# EAGLE design esp_0.3 (EAGLE 6.4)
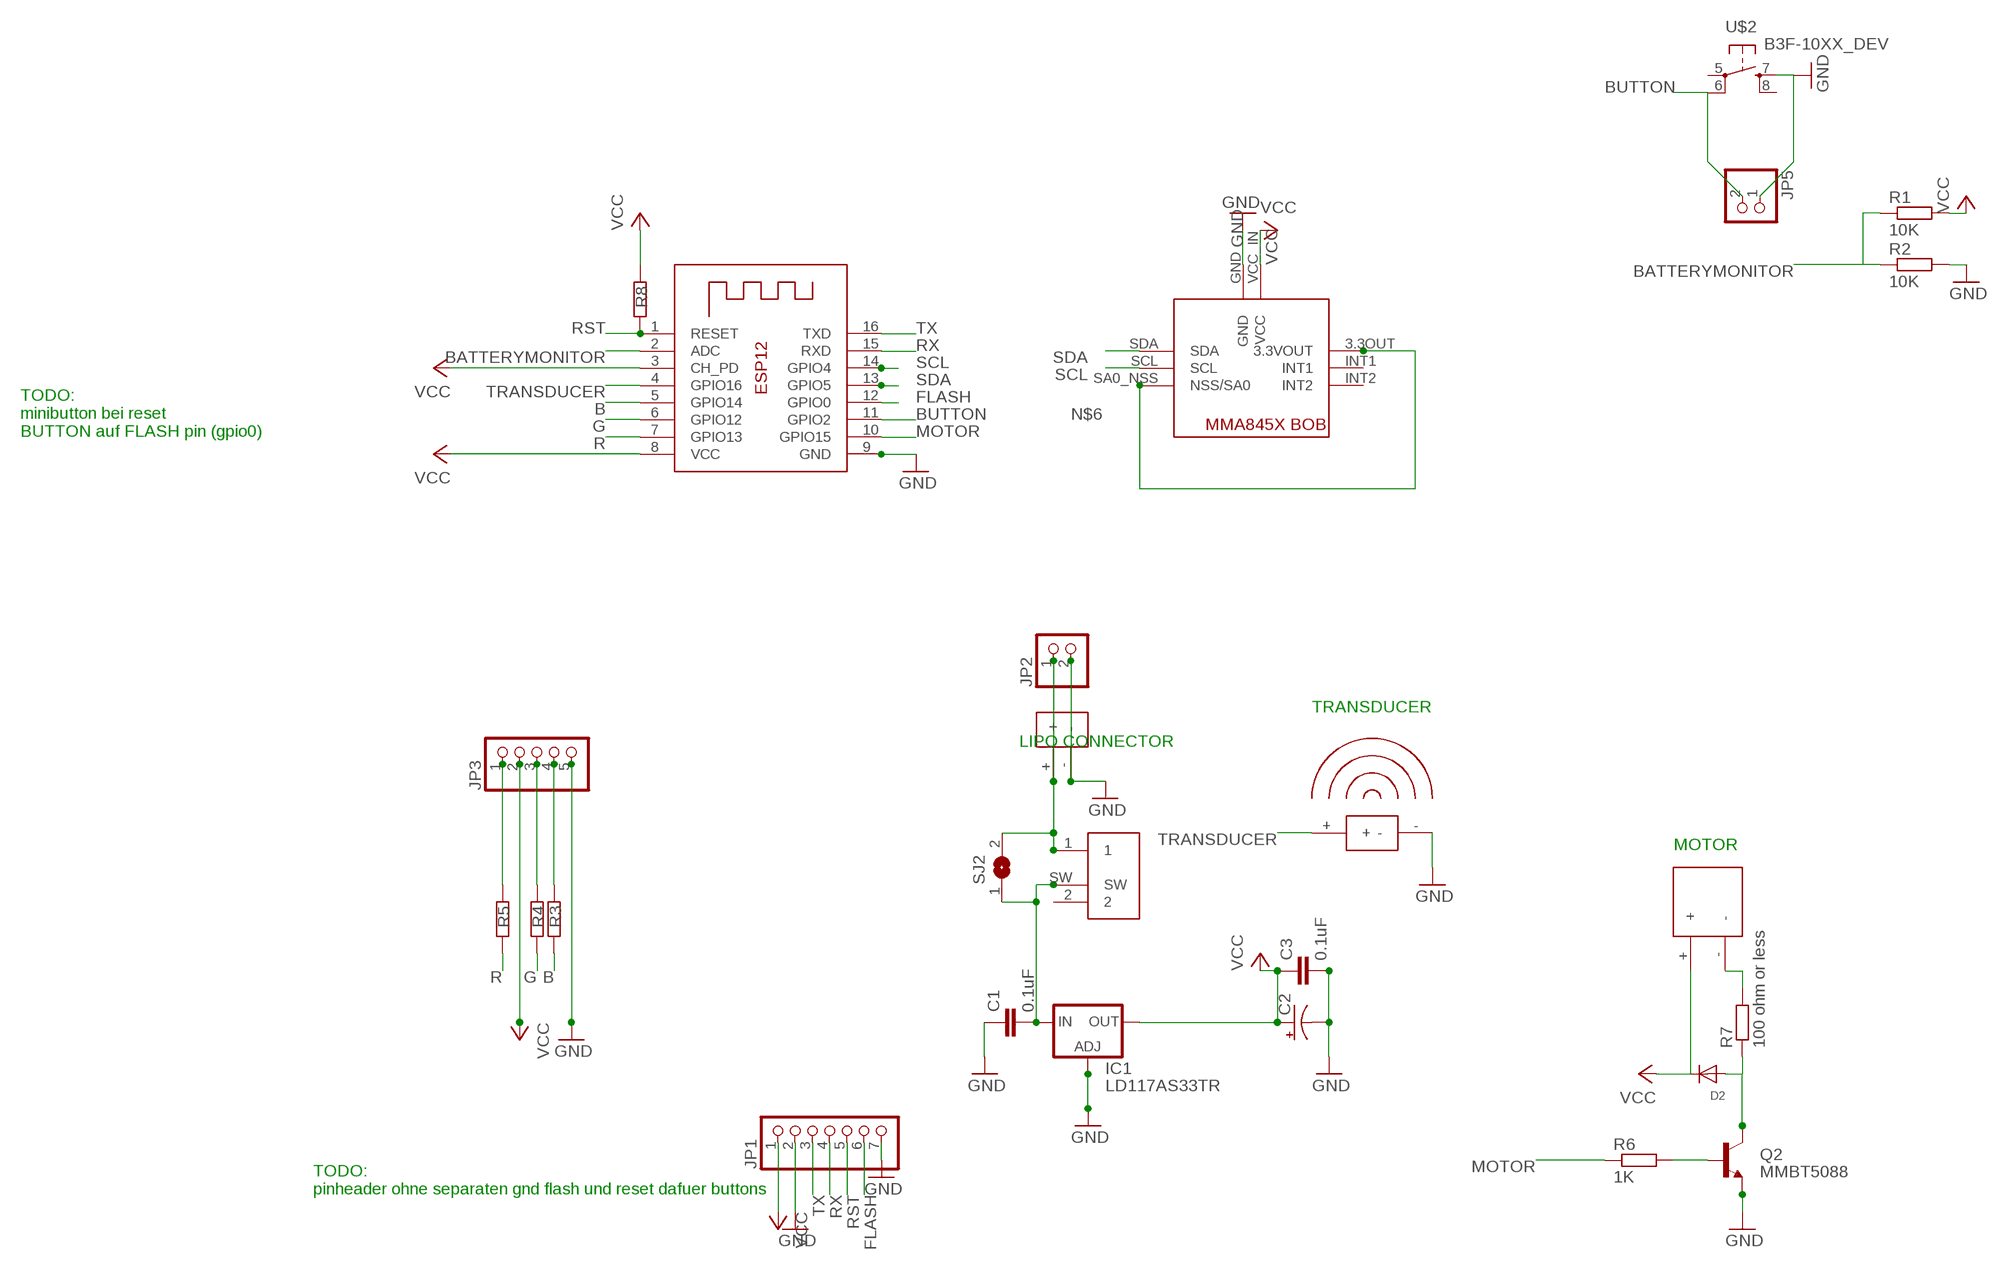
[diagram p0: schematic, sheet 1]

## Parts
C1  0.1uF  CAP0805  [0805]
C2  100UF-25V-20%(PTH)  [CPOL-RADIAL-100UF-25V]
C3  0.1uF  CAP0805  [0805]
D2  DIODE_SOD-123FL  [SOD-123FL]
IC1  LD117AS33TR  [SOT223]
JP1  PINHD-1X7  [1X07]
JP2  PINHD-1X2  [1X02]
JP3  PINHD-1X5  [1X05]
JP5  PINHD-1X2/90  [1X02/90]
Q2  MMBT5088  TRANSISTOR_NPNMMBT5088  [SOT23-3]
R1  10K  R-EU_R0805  [R0805]
R2  10K  R-EU_R0805  [R0805]
R3  1K  R-EU_R0805  [R0805]
R4  1K  R-EU_R0805  [R0805]
R5  1K  R-EU_R0805  [R0805]
R6  1K  R-EU_R0805  [R0805]
R7  100 ohm or less  R-EU_R0805  [R0805]
R8  56K pullup  R-EU_R0805  [R0805]
SJ2  SJ  [SJ]
U$1  MMA845X_BREAKOUT  [MMA845XBOB]
U$2  B3F-10XX_DEV  [B3F-10XX]
U$8  TRANSDUCER  [BMT1205XH7.5]
U$11  MICROSWITCH  [MICR_SCHIEBESCHALTER_CHINA_PAC]
U$12  VIBROMOTOR  [VIBRO]
U$13  LIPO  [LIPOCON]
X2  ESP-12  [ESP-12]

## Nets
B: R3.1 X2.5(GPIO14)
BATTERYMONITOR: R1.1 R2.1 X2.2(ADC)
BUTTON: JP5.2 U$2.6(P1) X2.11(GPIO2)
FLASH: JP1.6 X2.12(GPIO0)
G: R4.1 X2.6(GPIO12)
GND: C1.1 C2.2(-) C3.2 IC1.1(ADJ) JP1.2 JP1.7 JP2.2 JP3.5 JP5.1 Q2.2(E) R2.2 U$1.GND U$2.7(S) U$8.- U$13.- X2.9(GND)
MOTOR: R6.1 X2.10(GPIO15)
N$1: R7.2 U$12.-
N$2: JP2.1 SJ2.2 U$11.1 U$13.+
N$3: D2.A Q2.3(C) R7.1
N$4: Q2.1(B) R6.2
N$5: C1.2 IC1.3(IN) SJ2.1 U$11.SW
N$6: U$1.3.3OUT(3.3VOUT) U$1.SA0_NSS(NSS/SA0)
R: R5.1 X2.7(GPIO13)
RST: JP1.5 R8.1 X2.1(RESET)
RX: JP1.4 X2.15(RXD)
SCL: U$1.SCL X2.14(GPIO4)
SDA: U$1.SDA X2.13(GPIO5)
TRANSDUCER: U$8.+ X2.4(GPIO16)
TX: JP1.3 X2.16(TXD)
VCC: C2.1(+) C3.1 D2.C IC1.4(OUT) JP1.1 JP3.2 R1.2 R8.2 U$1.VCC_IN(VCC) U$12.+ X2.3(CH_PD) X2.8(VCC)
XX: JP3.1 R5.2
XXX: JP3.3 R4.2
XXXX: JP3.4 R3.2
Unconnected: U$1.INT1 U$1.INT2 U$2.5(P) U$2.8(S1) U$11.2

## Notes on the sheet
- TODO:
  minibutton bei reset
  BUTTON auf FLASH pin (gpio0)
- TRANSDUCER
- LIPO CONNECTOR
- MOTOR
- TODO:
  pinheader ohne separaten gnd flash und reset dafuer buttons

## Library data of the parts
C1 C3 = SparkFun-Passives:CAP: Capacitor Standard 0603 ceramic capacitor, and 0.1" leaded capacitor.
C2 = SparkFun-Capacitors:100UF-25V-20%(PTH): CAP-08439; PROD_ID: CAP-08439
D2 = adafruit:DIODE: Diode SMADIODE - SMA Surface Mount Package 20V 1A Schottky Diode Digikey: 641-1014-6-ND DO-1N4148 - Through Hole Small Current Diode SOD-123 20V 1 A (.5mV Vf) Schottky Diode - Digikey: MBRX120TPMSCT-ND SOD-323 10V 570mA (.38mV Vf, 3ns) Schottky Diode - Digikey: ZLLS410CT-ND SOD-523 30V 30mA Schottky Diode (RB751S-40TE61) - Digikey: RB751S-40TE61CT-ND SOT23-R/W - SOT23 Package (R = Solder Paste/Reflow Ovens, W = Hand-Soldering) BAT54Film 40V 300mA - Digikey: 497-7162-1-ND
IC1 = v-reg:LD117A?*: Low drop fixed and adjustable positive voltage regulators 1 A Source: http://www.st.com/stonline/products/literature/ds/7194/ld1117axx.pdf
JP1 = pinhead:PINHD-1X7: PIN HEADER
JP2 JP5 = pinhead:PINHD-1X2: PIN HEADER
JP3 = pinhead:PINHD-1X5: PIN HEADER
Q2 = SparkFun-DiscreteSemi:TRANSISTOR_NPN: Generic NPN BJT MMBT2222A - TRANS-08049 (SOT-23, 1A 40V) MPSA42 - TRANS-09116 (SOT-23, 500mA 300V) MMBT5088LT1G - TRANS-11160 (SOT-23, 50 mA 30V) BC547 - COM-08928 <http://www.sparkfun.com/products/8928> (TO-92 45V 100mA) (1.Collector 2.Base 3.Emitter) 2N3904 - COM-00521 <http://www.sparkfun.com/products/521> (TO-92 40V 200mA) (1.Emitter 2.Base 3.Collector) P2N2222A - COM-12852 <http://www.sparkfun.com/products/12852> (TO-92 40V 600mA) (1.Collector 2.Base 3.Emitter); PROD_ID: TRANS-11160
R1-R8 = resistor:R-EU_: RESISTOR, European symbol
SJ2 = jumper:SJ: SMD solder JUMPER
U$1 = roust:MMA845X_BREAKOUT
U$2 = timemachine:B3F-10XX_DEV
U$8 = ghoust:TRANSDUCER
U$11 = roust:MICROSWITCH
U$12 = ghoust:VIBROMOTOR
U$13 = roust:LIPO
X2 = adafruit:ESP-12

## Board
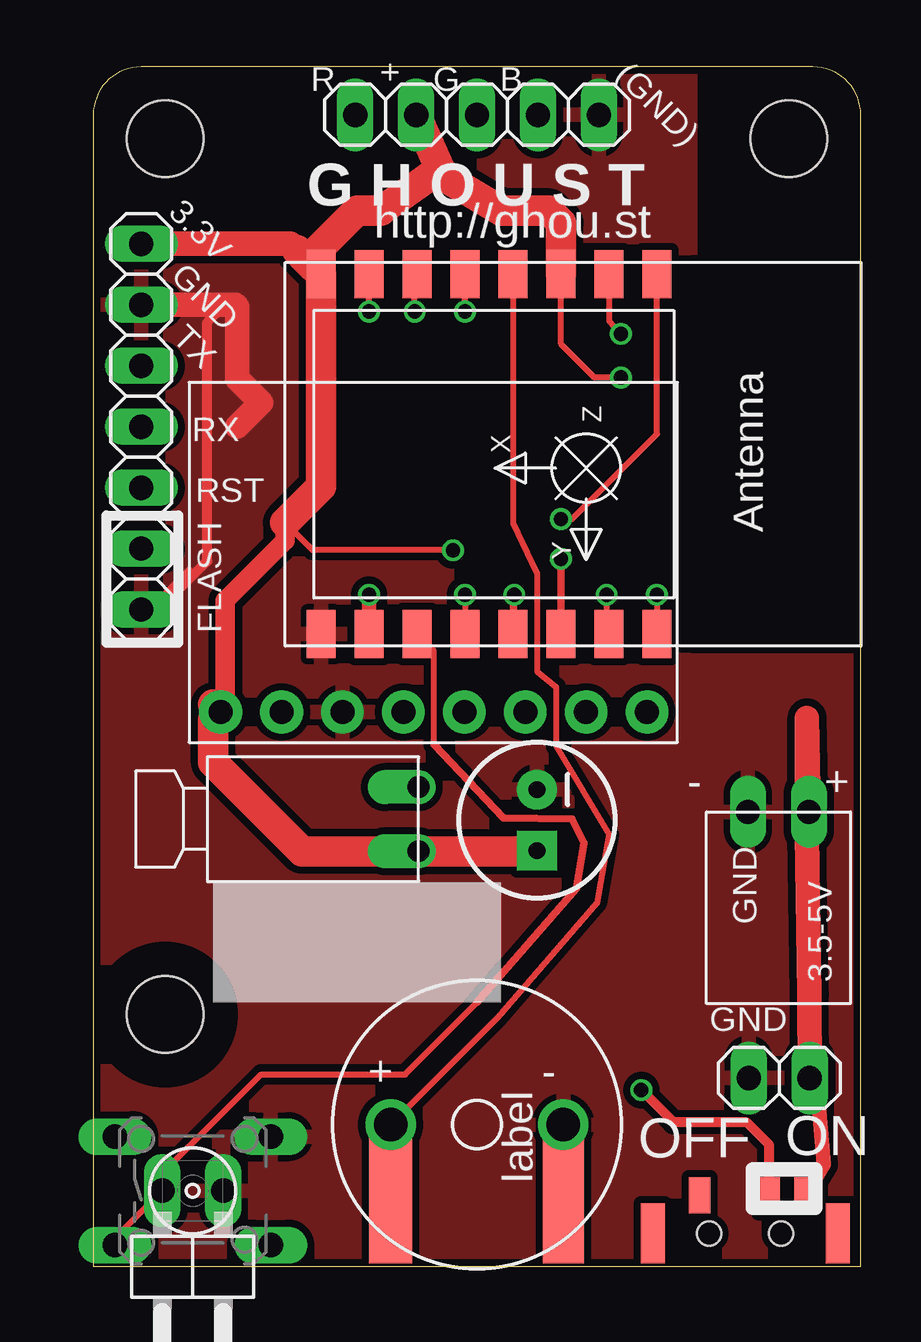
[diagram p1: board, top side]
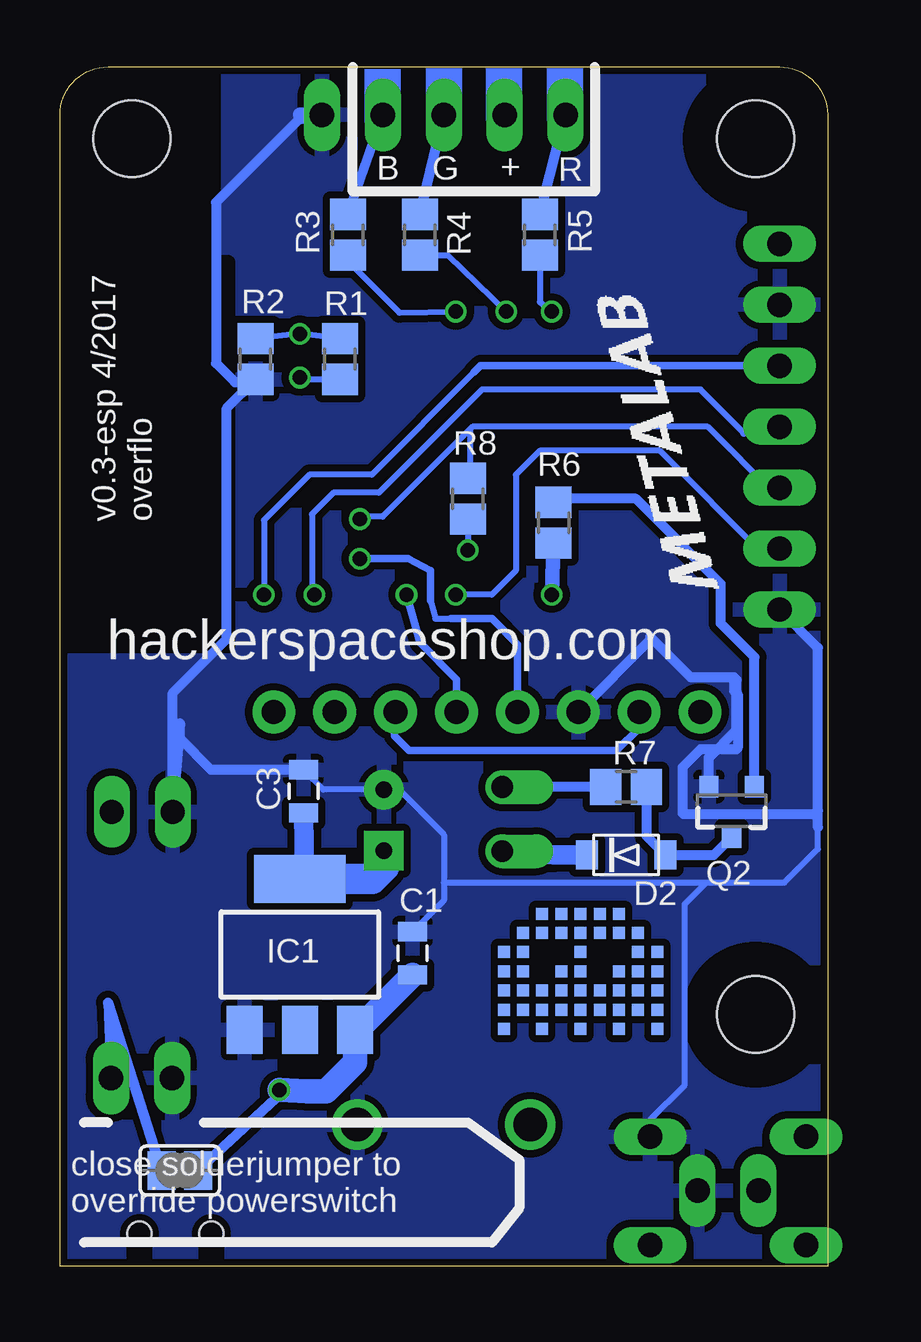
[diagram p2: board, bottom side, seen from below]

Size 32 x 50 mm. Coordinates in mm from the lower left corner, seen from the top.
Outline: 0,0 32,0 32,48 arc90 30,50 2,50 arc90 0,48 0,0
Copper layers (1*16): Top 0.035mm / dielectric 1.5mm / Bottom 0.035mm
Design rules "Fusion_eagle_rule_v1.1": minimum track width 6mil, minimum drill 12mil, track to track 6mil, track to pad 6mil, pad to pad 6mil, via to via 6mil, smd to smd 0mil, copper to edge 10mil, drill to drill 10mil, minimum pad ring 10mil, minimum via ring 6mil, stop-mask expansion 2mil, vias tented up to drill 100mil, thermal gap 10mil
Holes 3.2 mm at 3,10.5 29,47 3,47
tRestrict: area 0.4,7.9 to 5.6,13.1; area 26.4,44.4 to 31.6,49.6; area 0.4,44.4 to 5.6,49.6; area 25.5,26 to 34,50.7
bRestrict: area 0.4,7.9 to 5.6,13.1; area 26.4,44.4 to 31.6,49.6; area 0.4,44.4 to 5.6,49.6; area 25.6,26 to 34,50.7

### Footprints (pad centres in the part's own frame; a part is rotated, then mirrored left to right if it is on the bottom)
0805 = smd 0.8 x 1.2: 1 -0.9,0; 2 0.9,0
CPOL-RADIAL-100UF-25V = drill 0.7 pad 1.651 square: 1 1.27,0 | drill 0.7 pad 1.651: 2 -1.27,0
SOD-123FL = smd 0.91 x 1.22: A 1.637,0; C -1.637,0
SOT223 = smd 1.5 x 2: 1 -2.3,-3.15; 2 0,-3.15; 3 2.3,-3.15 | smd 3.8 x 2: 4 0,3.15
1X07 = drill 1.016 long: 1 -7.62,0; 2 -5.08,0; 3 -2.54,0; 4 0,0; 5 2.54,0; 6 5.08,0; 7 7.62,0
1X02 = drill 1.016 long: 1 -1.27,0; 2 1.27,0
1X05 = drill 1.016 long: 1 -5.08,0; 2 -2.54,0; 3 0,0; 4 2.54,0; 5 5.08,0
1X02/90 = drill 1.016 long: 1 -1.27,-3.81; 2 1.27,-3.81
SOT23-3 = smd 0.8 x 0.9: 1 -0.95,-1; 2 0.95,-1; 3 0,1.1
R0805 = smd 1.3 x 1.5: 1 -0.85,0; 2 0.85,0
SJ = smd 1.168 x 1.6: 1 -0.762,0; 2 0.762,0
MMA845XBOB = drill 1 pad 1.778: 3.3OUT 1.27,16.51; GND 1.27,13.97; INT1 1.27,1.27; INT2 1.27,3.81; SA0_NSS 1.27,6.35; SCL 1.27,11.43; SDA 1.27,8.89; VCC_IN 1.27,19.05
B3F-10XX = drill 1.016 long: 5 -3.251,2.261; 6 -3.251,-2.261; 7 3.251,2.261; 8 3.251,-2.261
GHOUST_LOGO = smd 0.5 x 0.5: P$1 0,0; P$2 -0.8,0; P$3 0.8,0; P$4 -1.6,0; P$5 1.6,0; P$6 -2.4,-0.8; P$7 -1.6,-0.8; P$8 -0.8,-0.8; P$9 0,-0.8; P$10 0.8,-0.8; P$11 1.6,-0.8; P$12 2.4,-0.8; P$13 -3.2,-1.6; P$14 -2.4,-1.6; P$15 3.2,-1.6; P$16 2.4,-1.6; P$17 0,-1.6; P$18 -3.2,-2.4; P$19 -2.4,-2.4; P$20 -0.8,-2.4; P$21 0,-2.4; P$22 1.6,-2.4; P$23 2.4,-2.4; P$24 3.2,-2.4; P$25 -3.2,-3.2; P$26 -2.4,-3.2; P$27 -0.8,-3.2; P$28 -1.6,-3.2; P$29 0,-3.2; P$30 0.8,-3.2; P$31 2.4,-3.2; P$32 1.6,-3.2; P$33 3.2,-3.2; P$34 -3.2,-4; P$35 -1.6,-4; P$36 0,-4; P$37 1.6,-4; P$38 2.4,-4; P$39 3.2,-4; P$40 0.8,-4; P$41 -0.8,-4; P$42 -2.4,-4; P$43 -3.2,-4.8; P$44 -1.6,-4.8; P$45 0,-4.8; P$46 1.6,-4.8; P$47 3.2,-4.8
BMT1205XH7.5 = drill 1.4: + -3.6,0; - 3.6,0 | smd 1.8 x 6: +_PAD -3.6,-2.77 | smd 1.7 x 6: _-PAD 3.6,-2.77
MICR_SCHIEBESCHALTER_CHINA_PAC = smd 0.9 x 1.5: 1 2.5,1.6; 2 -1.9,1.6; SW 1,1.6 | smd 1 x 2.5: GND1 -3.85,0; GND2 3.85,0 | hole 1: -1.5,0; 1.5,0
VIBRO = drill 0.9 pad 1.2 offset: + -1.34,0; - 1.34,0
LIPOCON = drill 1 long: + -1.27,0; - 1.27,0
ESP-12 = smd 2 x 1.2: 1 -7.5,4.5; 2 -7.5,2.5; 3 -7.5,0.5; 4 -7.5,-1.5; 5 -7.5,-3.5; 6 -7.5,-5.5; 7 -7.5,-7.5; 8 -7.5,-9.5; 9 7.5,-9.5; 10 7.5,-7.5; 11 7.5,-5.5; 12 7.5,-3.5; 13 7.5,-1.5; 14 7.5,0.5; 15 7.5,2.5; 16 7.5,4.5

### Placement (x,y rotation side)
C1  17.3,13.05 270 bottom
C2  18.5,18.6 270 top
C3  21.85,19.8 90 bottom
D2  8.4,17.15 0 bottom
IC1  22,13 0 bottom
JP1  2,35 270 top
JP2  28.6,7.85 180 top
JP3  16,48 0 top
JP5  4.15,-0.65 180 top
Q2  4,19 180 bottom
R1  20.32,37.82 270 bottom
R2  23.85,37.82 270 bottom
R3  20,43 90 bottom
R4  17,43 90 bottom
R5  12,43 90 bottom
R6  11.42,31 90 bottom
R7  8.4,19.99 180 bottom
R8  15,32 270 bottom
SJ2  27,4 180 bottom
U$1  24.36,21.84 90 top
U$2  4.15,3.15 0 top
U$4  [METALAB]  4.21,27.73 90 bottom
U$6  GHOUT_LOGO  [GHOUST_LOGO]  10.3,14.7 0 bottom
U$8  16,5.91 0 top
U$11  27.18,1.37 0 top
U$12  13.56,18.64 90 top
U$13  28.57,18.95 180 top
X2  19,33.85 270 top

### Tracks (layer width: path | path; a pad name or v marks a point on that pad's centre or on a via)
B  (via drill 0.6)
  Top 0.254: v15.5,39.8 X2.5
  Bottom 0.254: R3.1 20,41.9 17.85,39.75 v15.5,39.8
BATTERYMONITOR  (via drill 0.6)
  Top 0.254: X2.2 21.5,39.42 v22,38.87
  Bottom 0.254: R1.1 v22,38.87 R2.1
BUTTON
  Top 0.254: U$2.6 0.9,1.18 JP5.2 2.88,3.88 7,8 13,8 16,11 | 14.2,21.75 14.2,25.65 X2.11
  Top 0.305: 14.2,21.75 17.1,18.7 19.95,18.65 20.45,17.65 20.15,15.75 16,11
FLASH  (via drill 0.6)
  Top 0.254: v15.5,28 X2.12
  Bottom 0.254: 2.65,29.65 7,34 12,34 13,33 13,29 14,28 v15.5,28
  Bottom 0.305: JP1.6 2.38,29.92 2.65,29.65
G  (via drill 0.6)
  Top 0.254: v13.4,39.8 13.4,41.25 X2.6
  Bottom 0.254: R4.1 15.85,42.15 v13.4,39.8
GND
  Top 0.305: 2,27 4,29
  Top 0.406: 2,27 2.35,27 4.75,29.4 4.75,39.35 5.35,39.95 2.05,39.95 2,40
  Top 1.016: JP1.2 5.92,40.08 6,40 6,37 7,36 6,35
  Bottom 0.254: 16,16 16,15.25 C1.1 | 16,16 16,18 17.87,19.87 C2.2 21.02,19.87 C3.2 | 16,16 5.05,16 | 5.05,16 1.8,16 0.4,17.4 0.4,18.3 | U$2.7 7.4,6.1 5.95,7.55 5.95,15.1 5.05,16
  Bottom 0.406: Q2.2 4.95,21.2 3.8,22.35 3.8,24.45 3.9,24.55 | 3.9,24.55 5.7,24.55 7.4,26.25 7.4,26.1 U$1.GND | 0.4,18.3 0.4,19 | 0.4,19 0.4,25.78 JP1.7 | C3.2 25.7,20.7 27,22 27,22.65 U$13.- 27.3,23.9 25.05,26.15 25.05,35.77 R2.2 23.97,36.85 24.7,36.85 25.5,37.65 25.5,44.35 22.08,47.77 JP3.5 | 3.9,24.55 3.9,24 3.75,23.85 3.75,21.6 3.8,21.55 5.3,21.55 6.05,20.8 6.05,18.9 6,18.85 0.55,18.85 0.4,19
  Bottom 0.61: JP3.5 22,48
  pour Top (isolate 0.3): -1,51 34,51 34,-2 -1,-2
  pour Bottom (isolate 0.3): -1,51 34,51 34,-2 -1,-2
MOTOR  (via drill 0.6)
  Top 0.61: v11.5,28 X2.10
  Bottom 0.61: R6.1 v11.5,28
N$1
  Bottom 0.406: R7.2 U$12.-
N$2
  Top 0.61: U$11.1 30.45,4.25 29.86,11.34
  Top 1.016: 29.75,17.7 29.75,18 | 29.75,18 29.75,22.86 U$13.+ | JP2.1 29.86,11.34 29.75,18
  Bottom 0.406: SJ2.2 30,11 JP2.1
N$3
  Bottom 0.406: R7.1 7.55,17.94 D2.A 4.75,17.15 Q2.3
N$4
  Bottom 0.406: R6.2 11.27,32 8,32 4.45,28.45 4.45,26.8 3.05,25.4 Q2.1
N$5  (via drill 0.6)
  Top 0.406: U$11.SW 28.18,5.06 27.24,6 24.2,6 v22.85,7.35
  Bottom 0.406: SJ2.1 23,7 v22.85,7.35
  Bottom 1.016: v22.85,7.35 21.7,7.3 20.9,7.3 19.7,8.5 IC1.3 19.6,9.85 C1.2
N$6
  Bottom 0.305: U$1.3.3OUT 7.85,22.45 8.8,21.5 17.45,21.5 18.05,22.1 18.05,23.07 U$1.SA0_NSS
R  (via drill 0.6)
  Top 0.254: v11.5,39.8 X2.7
  Bottom 0.254: R5.1 12,40.2 v11.5,39.8
RST  (via drill 0.6)
  Top 0.254: v19.5,31.15 19.95,31.15 23.5,34.7 X2.1
  Bottom 0.254: 2.19,32.19 5,35 14.8,35 14.9,34.9 | 14.9,34.9 18.55,31.25 19.7,31.25 v19.5,31.15 | 14.9,34.9 14.9,32.95 R8.1
  Bottom 0.305: JP1.5 2,32.38 2.19,32.19
RX  (via drill 0.6)
  Top 0.254: v21.4,28 21.4,26.45 X2.15
  Bottom 0.254: 3.48,34.73 5.3,36.55 14.4,36.55 18.7,32.25 20.6,32.25 21.5,31.35 21.5,28.1 v21.4,28
  Bottom 0.305: JP1.4 3.21,35 3.48,34.73
SCL  (via drill 0.6)
  Top 0.305: v19.5,29.5 X2.14
  Bottom 0.254: 16.55,27.75 16.35,27 15.7,27
  Bottom 0.305: U$1.SCL 12.93,25.93 14,27 15.7,27 | v19.5,29.5 17.5,29.5 16.55,29 16.55,27.75
SDA  (via drill 0.6)
  Top 0.305: v17.55,28 X2.13
  Top 0.406: 17.47,26.47 X2.13
  Bottom 0.305: U$1.SDA 15.47,24.47 17,26 v17.55,28
TRANSDUCER
  Top 0.254: X2.4 17.5,31 18.5,28.9 18.5,24.8 19.3,24.15 19.3,21.7 21.5,18 21,15.15 16.85,10.36 U$8.+
TX  (via drill 0.6)
  Top 0.254: v23.5,28 X2.16
  Bottom 0.254: 14.73,37.27 19,33 21.6,33 23.5,31.1 v23.5,28
  Bottom 0.305: JP1.3 14.46,37.54 14.73,37.27
VCC  (via drill 0.6)
  Top 0.254: v22,37.05 20.9,37.05 19.5,38.45 X2.3 | v15,29.85 9.15,29.85 8,31
  Top 0.406: 18.47,17.3 C2.1
  Top 0.813: 8,31 8,30.25 5.5,27.75 5.5,23.2 5,22.7
  Top 1.016: JP1.1 8.23,42.62 8.5,42.35
  Top 1.27: X2.3 19.5,43.5 19,44 17,44 14.29,45.63 | 8.5,42.35 8.93,41.92 | 8.93,41.92 X2.8 9.5,32.5 8,31 | 8.93,41.92 11,44 12,44 14.29,45.63 | 5,23.42 U$1.VCC_IN 5,22.8 5,22.7 5,21 8.7,17.3 U$12.+ 18.47,17.3 | JP3.2 14.45,45.75 14.29,45.63
  Bottom 0.254: R1.2 21.97,36.97 v22,37.05 | R8.2 v15,29.85
  Bottom 0.813: D2.C 11.41,17.15 U$12.+ | C3.1 21.8,16.15
  Bottom 1.27: IC1.4 21.8,16.15 19,16.15 18.5,16.65 C2.1
XX
  Bottom 0.406: R5.2 JP3.1
XXX
  Bottom 0.406: R4.2 JP3.3
XXXX
  Bottom 0.406: R3.2 JP3.4
  Bottom 0.61: JP3.4 19,48
(copper drawn outside any net)
  shapes: Bottom area x4

### Text on the board
tPlace: G H O U S T | http://ghou.st | OFF | ON
bPlace: v0.3-esp 4/2017 / overflo | hackerspaceshop.com | close solderjumper to / override powerswitch
tNames: R | + | G | B | (GND) | 3.3V | GND | TX | RX | RST | FLASH | GND | 3.5-5V | GND
bNames: R | + | G | B
bStop: GHOUST